# Altium schematic sheet Block_Diagram.SchDoc: Project Vega - Client Node
size A4; DrawnBy: Jithendra H S; Revision: 1; SheetNumber: 1; SheetTotal: 5
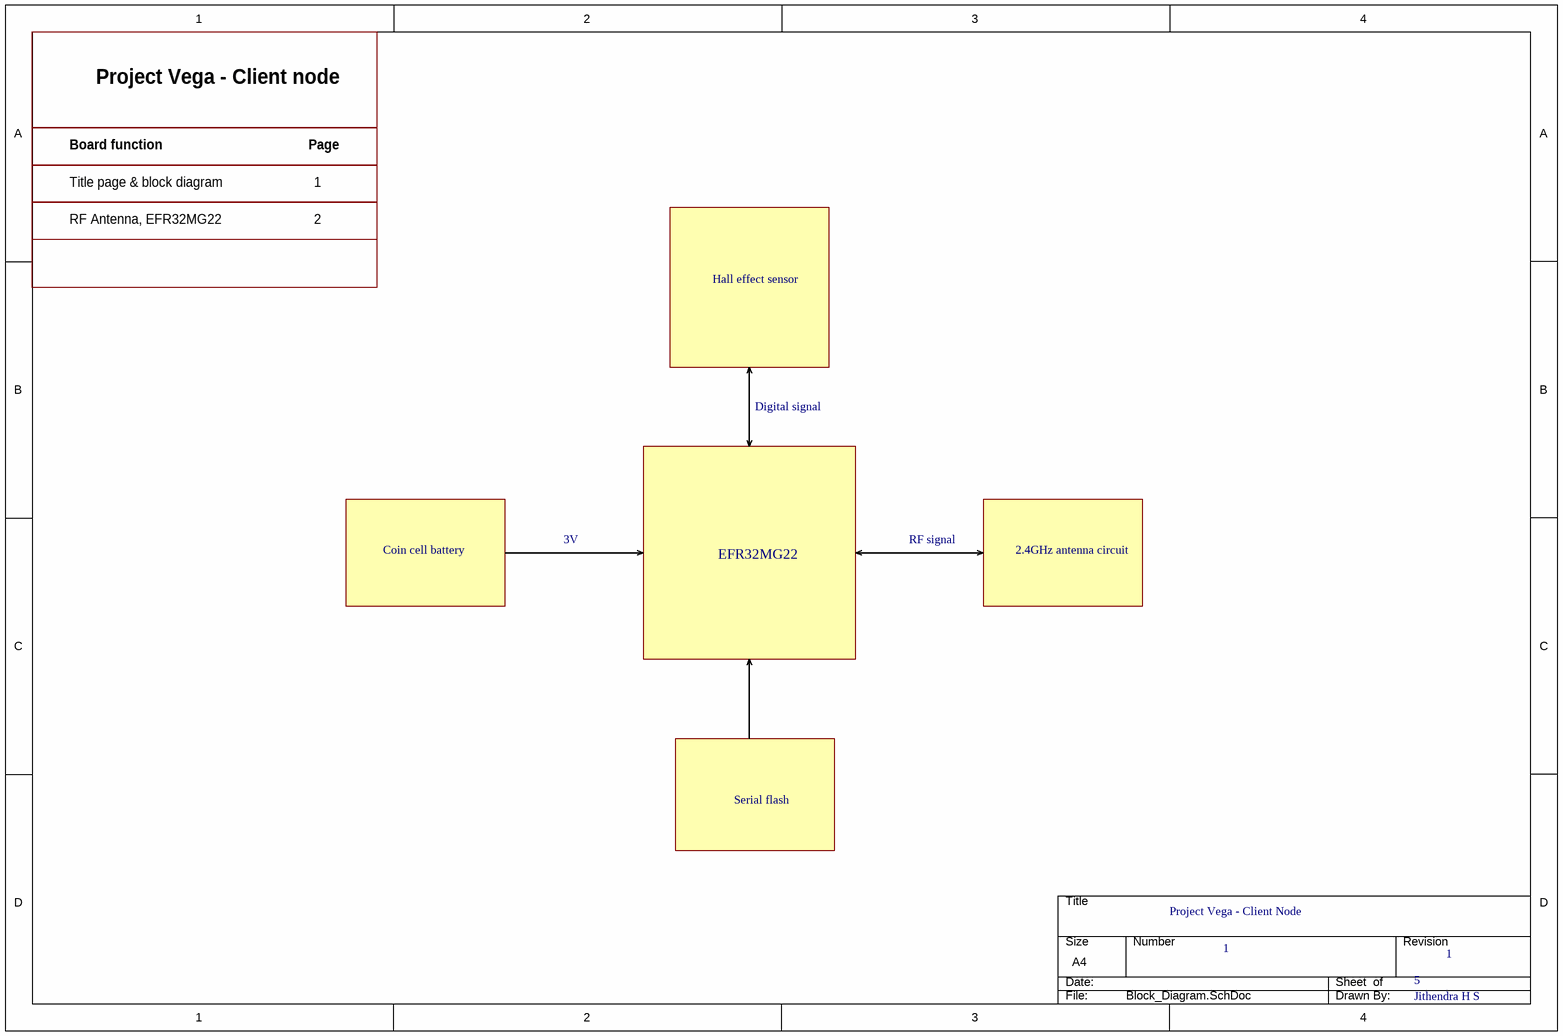
[diagram p0: Block_Diagram.SchDoc]

## Notes on the sheet
- Project Vega - Client node
- Board function
- Page
- Title page & block diagram
- RF Antenna, EFR32MG22
- 1
- 2
- Hall effect sensor
- Digital signal
- Coin cell battery
- 3V
- EFR32MG22
- RF signal
- 2.4GHz antenna circuit
- Serial flash